# Altium project FSK-Modulator-V1.PrjPcb
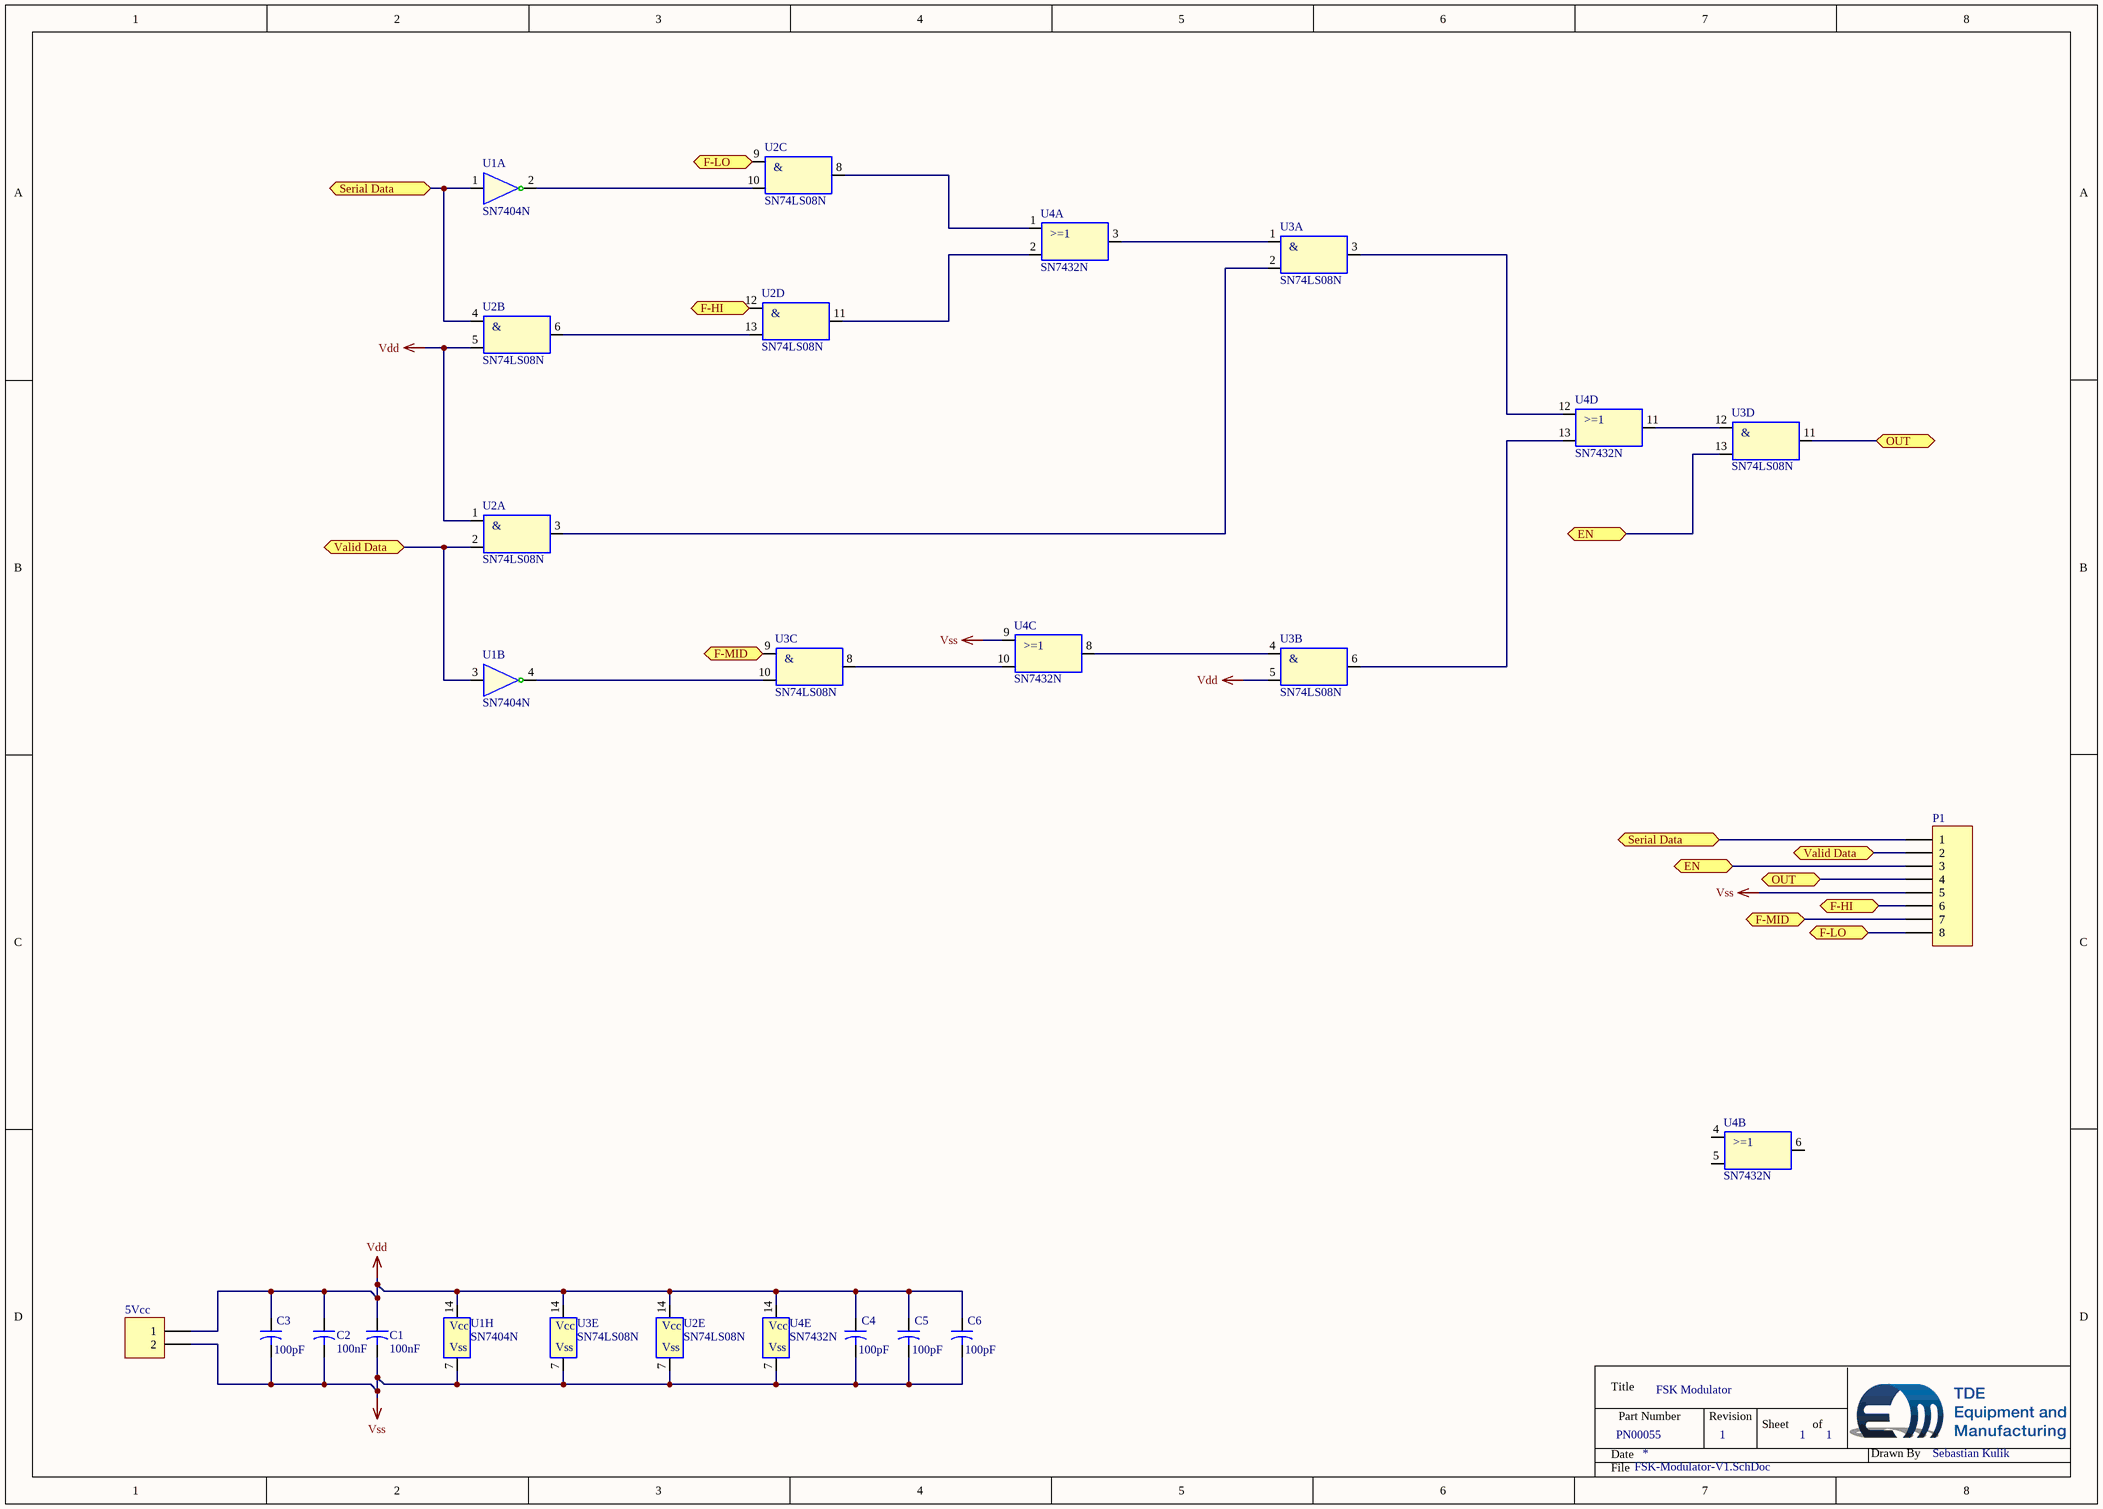
[diagram p0: FSK-Modulator-V1.SchDoc]
1 sheet, 12 parts. Net scope: flat (ports and power ports of the same name join across sheets).
Board file: FSK-Modulator-V1.PcbDoc

## Sheet FSK-Modulator-V1.SchDoc: FSK Modulator
size A3; Revision: 1; SheetNumber: 1; SheetTotal: 1; PartNumber: PN00055; Drawn By: Sebastian Kulik

### Parts
5Vcc  PHOENIX_1715721  [Phoenix-2-5_08]  (value not drawn)
C1  value 100nF  [Dummy-10mm]  (hidden comment: Capacitor-Dummy-THT)
C2  value 100nF  [Dummy-10mm]  (hidden comment: Capacitor-Dummy-THT)
C3  value 100pF  [Dummy-10mm]  (hidden comment: Capacitor-Dummy-THT)
C4  value 100pF  [Dummy-10mm]  (hidden comment: Capacitor-Dummy-THT)
C5  value 100pF  [Dummy-10mm]  (hidden comment: Capacitor-Dummy-THT)
C6  value 100pF  [Dummy-10mm]  (hidden comment: Capacitor-Dummy-THT)
P1  Plug_08_2.54  [HDR1X8_2.54]  (value not drawn)
U1  SN7404N  [DIP-14]  (parts A,B,H of 8)
U2  SN74LS08N  [DIP-14]  (parts A,B,C,D,E of 5)
U3  SN74LS08N  [DIP-14]  (parts A,B,C,D,E of 5)
U4  SN7432N  [DIP-14]  (parts A,B,C,D,E of 5)

### Ports
EN, F-HI, F-LO, F-MID, OUT, Serial Data, Valid Data

### Nets
Vdd: 5Vcc.1 C1.1 C2.1 C3.1 C4.1 C5.1 C6.1 U1.14(Vcc) U2.1(1A) U2.5(2B) U2.14(Vcc) U3.5(2B) U3.14(Vcc) U4.14(Vcc)
Vss: 5Vcc.2 C1.2 C2.2 C3.2 C4.2 C5.2 C6.2 P1.5 U1.7(Vss) U2.7(Vss) U3.7(Vss) U4.7(Vss) U4.9(3A)
NetP1_1: P1.1 U1.1(1A) U2.4(2A) ; port Serial Data
NetP1_2: P1.2 U1.3(2A) U2.2(1B) ; port Valid Data
NetP1_3: P1.3 U3.13(4B) ; port EN
NetP1_4: P1.4 U3.11(Y4) ; port OUT
NetP1_6: P1.6 U2.12(4A) ; port F-HI
NetP1_7: P1.7 U3.9(3A) ; port F-MID
NetP1_8: P1.8 U2.9(3A) ; port F-LO
NetU1_2: U1.2(1Y) U2.10(3B)
NetU1_4: U1.4(2Y) U3.10(3B)
NetU2_3: U2.3(Y1) U3.2(1B)
NetU2_6: U2.6(Y2) U2.13(4B)
NetU2_8: U2.8(Y3) U4.1(1A)
NetU2_11: U2.11(Y4) U4.2(1B)
NetU3_1: U3.1(1A) U4.3(Y1)
NetU3_3: U3.3(Y1) U4.12(4A)
NetU3_4: U3.4(2A) U4.8(Y3)
NetU3_6: U3.6(Y2) U4.13(4B)
NetU3_8: U3.8(Y3) U4.10(3B)
NetU3_12: U3.12(4A) U4.11(Y4)

Not connected (* = marked no-connect by the designer): U4 4(2A) 5(2B) 6(Y2)

### Notes on the sheet
- Title
- Date
- Part Number
- Revision
- Sheet
- of
- Drawn By
- File
- (in symbol SN74LS08N, part A) &
- (in symbol SN74LS08N, part B) &
- (in symbol SN74LS08N, part C) &
- (in symbol SN74LS08N, part D) &
- (in symbol SN7432N, part A) >=1
- (in symbol SN7432N, part B) >=1
- (in symbol SN7432N, part C) >=1
- (in symbol SN7432N, part D) >=1

### Library data of the parts
5Vcc = 2Pol_1715721: Phoenix, 2 pol, 5.08mm, 22A, 715721; Deliverer PartNr: 193-0564; Deliverer: RS; TDE-PN: CON0008; LatestRevisionDate: 02.05.2014; LatestRevisionNote: Re-released for DXP Platform.; Publisher: Sebastian Kulik; Manufacturer PartNr: 1715721; Manufacturer: Phoenix; PackageDescription: Phoenix-2-5_08; Price: 0.976/5
C1 C2 = Capacitor-Dummy-THT: Deliverer PartNr: 721-5240; Deliverer: RS; Published: 08.12.2015; Part Description: Capacitor-Dummy-THT; Publisher: Sebastian Kulik; PackageDescription: -; Manufacturer: -; Manufacturer PartNr: -; TDE-PN: -; Price: 0.081/50
C3-C6 = Capacitor-Dummy-THT: Deliverer PartNr: 117-344; Deliverer: RS; Published: 08.12.2015; Part Description: Capacitor-Dummy-THT; Publisher: Sebastian Kulik; PackageDescription: -; Manufacturer: -; Manufacturer PartNr: -; TDE-PN: -; Price: 0.09/10
P1 = Plug_08_2.54: Plug, 08-Pin; Manufacturer PartNr: 61300811121; Manufacturer: WE; TDE-PN: CON0035; LatestRevisionDate: 11.11.2014; LatestRevisionNote: Re-released for DXP Platform.; Publisher: Sebastian Kulik; Deliverer: WE; Deliverer PartNr: 61300811121
U1 = SN7404N: Hex Inverter TTL; Deliverer PartNr: 305-529; Manufacturer: TI; Deliverer: RS; TDE-PN: IC0086; Published: 24.11.2016; PackageDescription: DIP14; Publisher: Sebastian Kulik; Manufacturer PartNr: SN7404N; Price: 1
U2 U3 = SN74LS08N: Quad AND, TTL; Deliverer PartNr: 307-519; Manufacturer: TI; Deliverer: RS; TDE-PN: IC0088; Published: 24.11.2016; PackageDescription: DIP14; Publisher: Sebastian Kulik; Manufacturer PartNr: SN74LS08N; Price: 0.56
U4 = SN7432N: Quad NAND, TTL; Deliverer PartNr: 304-093; Manufacturer: TI; Deliverer: RS; TDE-PN: IC0087; Published: 24.11.2016; PackageDescription: DIP14; Publisher: Sebastian Kulik; Manufacturer PartNr: SN7432N; Price: 1.24